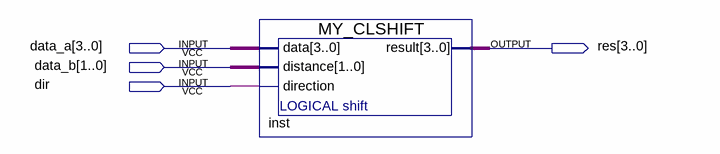
[diagram p0: schematic sheet]
// Quartus schematic alu.bdf as structural Verilog: 1 symbols, 4 pins
module alu (
  input  [3:0] data_a,
  input  [1:0] data_b,
  input  dir,
  output [3:0] res
);

  MY_CLSHIFT inst (.data(data_a), .distance(data_b), .direction(dir), .result(res));
endmodule
